# Altium schematic sheet CH340G USB TO SERIAL MODULE.SchDoc
size A
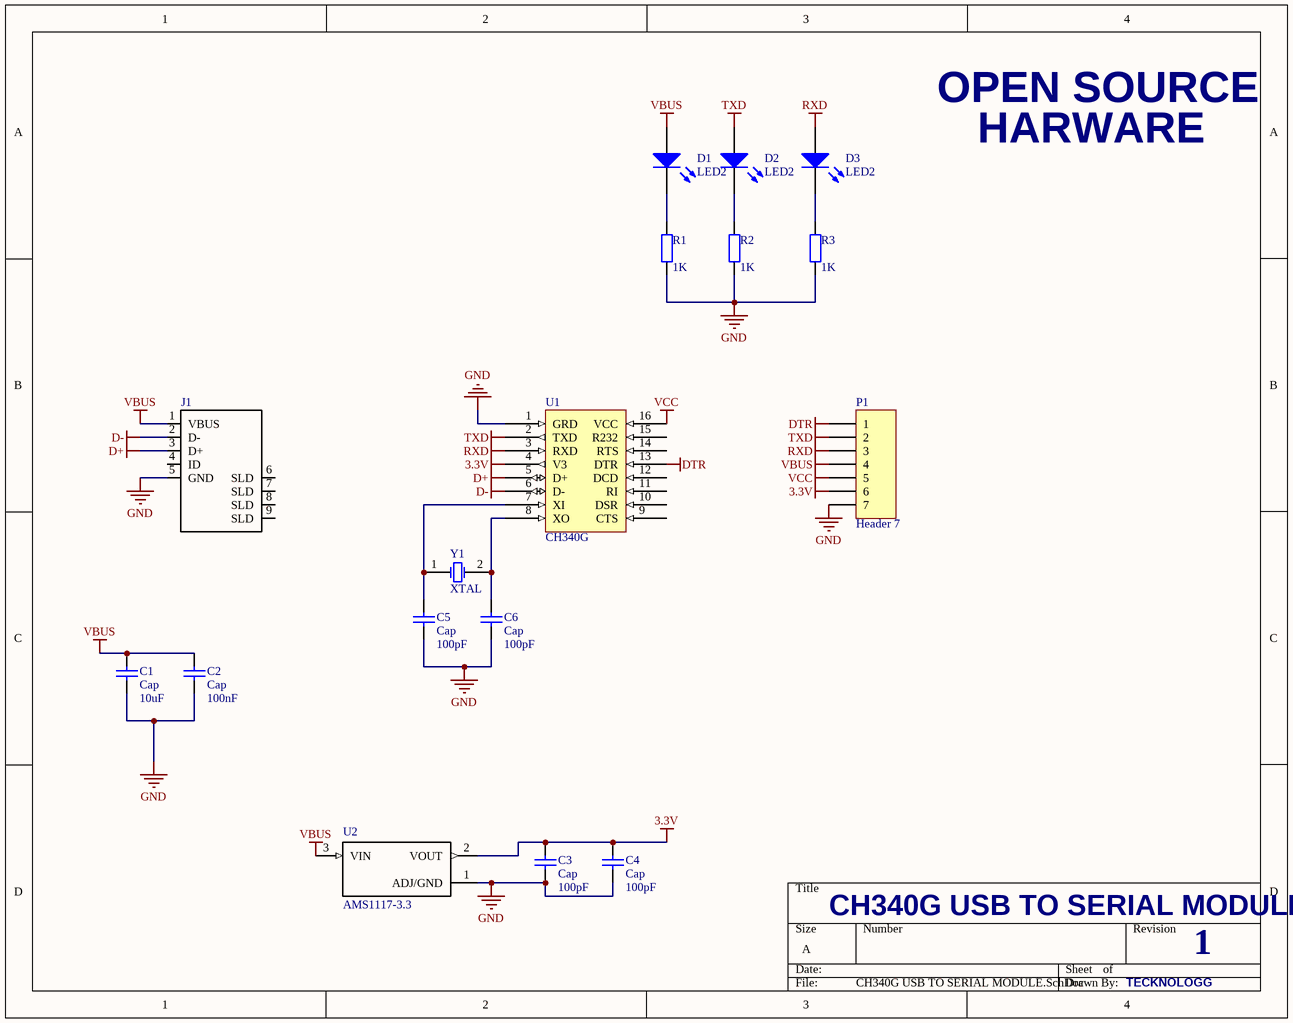
[diagram p0: CH340G USB TO SERIAL MODULE.SchDoc]

## Parts
C1  Cap  value 10uF  [RAD-0.3]
C2  Cap  value 100nF  [RAD-0.3]
C3  Cap  value 100pF  [RAD-0.3]
C4  Cap  value 100pF  [RAD-0.3]
C5  Cap  value 100pF  [RAD-0.3]
C6  Cap  value 100pF  [RAD-0.3]
D1  LED2  [3.2X1.6X1.1]
D2  LED2  [3.2X1.6X1.1]
D3  LED2  [3.2X1.6X1.1]
J1  1734035-1  [*TE_1734035-1]  (value not drawn)
P1  Header 7  [HDR1X7]
R1  value 1K  [AXIAL-0.4]
R2  value 1K  [AXIAL-0.4]
R3  value 1K  [AXIAL-0.4]
U1  CH340G
U2  AMS1117-3.3  [*SOT229P700X180-4N]
Y1  XTAL  [R38]

## Nets
3.3V: C3.2 C4.2 P1.6 U1.4(V3) U2.2(VOUT)
D+: J1.3(D+) U1.5(D+)
D-: J1.2(D-) U1.6(D-)
DTR: P1.1 U1.13(DTR)
GND: C1.1 C2.1 C3.1 C4.1 C5.1 C6.1 J1.5(GND) P1.7 R1.1 R2.2 R3.2 U1.1(GRD) U2.1(ADJ/GND)
RXD: D3.1(A) P1.3 U1.3(RXD)
TXD: D2.1(A) P1.2 U1.2(TXD)
VBUS: C1.2 C2.2 D1.1(A) J1.1(VBUS) P1.4 U2.3(VIN)
VCC: P1.5 U1.16(VCC)
NetC5_2: C5.2 U1.7(XI) Y1.1(OSC1)
NetC6_2: C6.2 U1.8(XO) Y1.2(OSC2)
NetD1_2: D1.2(K) R1.2
NetD2_2: D2.2(K) R2.1
NetD3_2: D3.2(K) R3.1

Not connected (* = marked no-connect by the designer): J1 4(ID) 6(SLD) 7(SLD) 8(SLD) 9(SLD); U1 9(CTS) 10(DSR) 11(RI) 12(DCD) 14(RTS) 15(R232)

## Notes on the sheet
- OPEN SOURCE
- HARWARE
- CH340G USB TO SERIAL MODULE
- 1
- TECKNOLOGG

## Library data of the parts
C1-C6 = Cap: Capacitor; Published: 8-Jun-2000; LatestRevisionDate: 17-Jul-2002; LatestRevisionNote: Re-released for DXP Platform.; PackageReference: RAD-0.3; Publisher: Altium Limited; PackageDescription: Radial Cap, Thru-Hole; 2 Leads; 0.3 in Pin Spacing
D1-D3 = LED2: Typical RED, GREEN, YELLOW, AMBER GaAs LED; Published: 8-Jun-2000; LatestRevisionDate: 17-Jul-2002; LatestRevisionNote: Re-released for DXP Platform.; PackageVersion: Feb-2002; PackageReference: 3.2X1.6X1.1; Publisher: Altium Limited; PackageDescription: SM LED; 2 Flat Leads
J1 = 1734035-1: Mini USB,R/A,SMT,B Type,pbFree; Number_of_Positions: 5; Product_Type: Connector; Centerline_Pitch: .8 mm[.031 in]; MF: TE Connectivity; Availability: Unavailable; TE_purchase_URL: https://www.te.com/usa-en/product-1734035-1.html?te_bu=Cor&te_type=disp&te_campaign=seda_glo_cor-seda-global-disp-prtnr-fy19-seda-model-bom-cta_sma-317_1&elqCampaignId=32493; Price: None; MP: 1734035-1; Package: None; SnapEDA_Link: https://www.snapeda.com/parts/1734035-1/TE%20Connectivity%20AMP%20Connectors/view-part/?ref=snap; EU_RoHS_Compliance: Compliant; Value: *
P1 = Header 7: Header, 7-Pin; LatestRevisionDate: 17-Jul-2002; LatestRevisionNote: Re-released for DXP Platform.; Publisher: Altium Limited
R1-R3 = Res2: Resistor; Published: 8-Jun-2000; LatestRevisionDate: 17-Jul-2002; LatestRevisionNote: Re-released for DXP Platform.; PackageReference: AXIAL-0.4; Publisher: Altium Limited; PackageDescription: Axial Device, Thru-Hole; 2 Leads; 0.4 in Pin Spacing
U2 = AMS1117-3.3: Sot223/Pkg 1-Amp 3.3-Volt Low Drop Out Voltage Regulatator; MF: Advanced Monolithic Systems; Package: None; MP: AMS1117-3.3; SnapEDA_Link: https://www.snapeda.com/parts/AMS1117-3.3/Advanced%20Monolithic%20Systems/view-part/?ref=snap; Availability: Unavailable; Price: None; Value: *
Y1 = XTAL: Crystal Oscillator; Published: 8-Jun-2000; LatestRevisionDate: 17-Jul-2002; LatestRevisionNote: Re-released for DXP Platform.; PackageReference: R38; Publisher: Altium Limited; PackageDescription: Crystal, Thru-Hole; 2 Leads; Body 3.1 x 8.2 mm (Dia.xH)